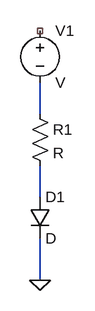
[diagram p0: schematic Draft3.asc]
Draft3.asc, the LTspice schematic file:
Version 4
SHEET 1 880 680
WIRE 208 160 208 112
WIRE 208 288 208 240
WIRE 208 416 208 352
FLAG 208 416 0
SYMBOL voltage 208 16 R0
SYMATTR InstName V1
SYMBOL res 192 144 R0
SYMATTR InstName R1
SYMBOL diode 192 288 R0
SYMATTR InstName D1

The netlist it stands for:
* Draft3.asc
V1 NC_01 N001 V
R1 N001 N002 R
D1 N002 0 D
.model D D
.lib standard.dio
.backanno
.end